# Altium schematic sheet USB_Charging.SchDoc
size A; SheetNumber: 4; SheetTotal: 5
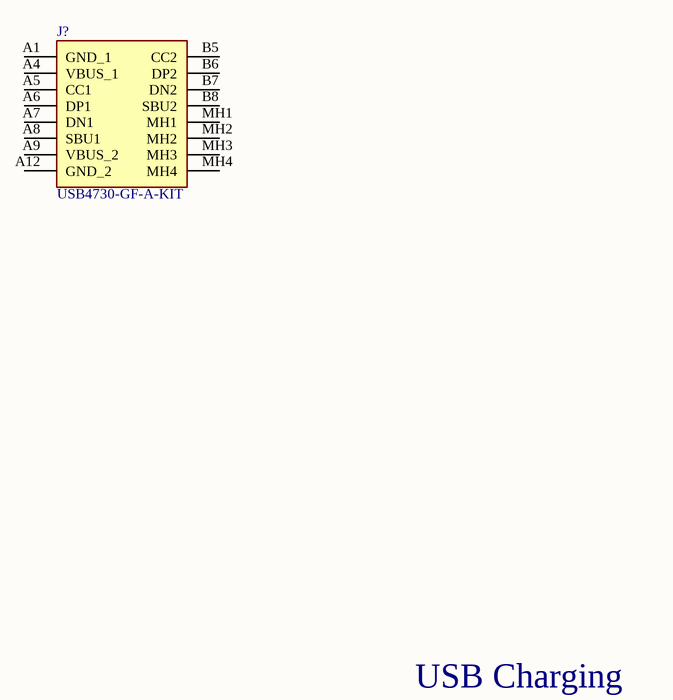
[diagram p0: USB_Charging.SchDoc]

## Parts
J?  USB4730-GF-A-KIT  [USB4730GFAKIT]

## Nets

Not connected (* = marked no-connect by the designer): J? A1(GND_1) A4(VBUS_1) A5(CC1) A6(DP1) A7(DN1) A8(SBU1) A9(VBUS_2) A12(GND_2) B5(CC2) B6(DP2) B7(DN2) B8(SBU2) MH1 MH2 MH3 MH4

## Notes on the sheet
- USB Charging

## Library data of the parts
J? = USB4730-GF-A-KIT: Connector; Manufacturer_Name: GCT (GLOBAL CONNECTOR TECHNOLOGY); Datasheet Link: https://www.gct.co/files/drawings/USB4730.pdf; Height: 4.81mm; Manufacturer_Part_Number: USB4730-GF-A-KIT; Mouser Part Number: 640-USB4730GFAKIT; Mouser Price/Stock: https://www.mouser.co.uk/ProductDetail/GCT/USB4730-GF-A-KIT?qs=Z%252BL2brAPG1IoU%252BBwnQ%2FE8Q%3D%3D